# EAGLE schematic masterV05a (EAGLE 6.1), part 2 of 2
## Sheet 11 of 11
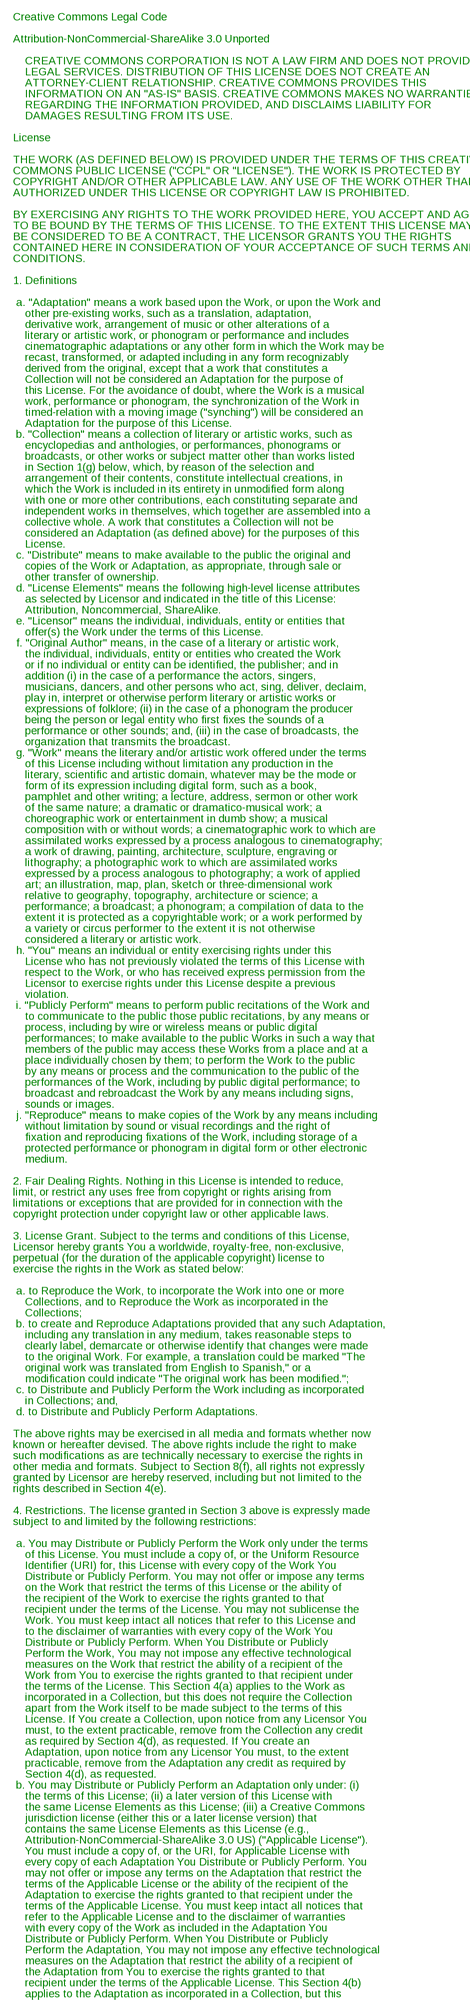
[diagram p10: schematic, sheet 11, part 1 of 2]
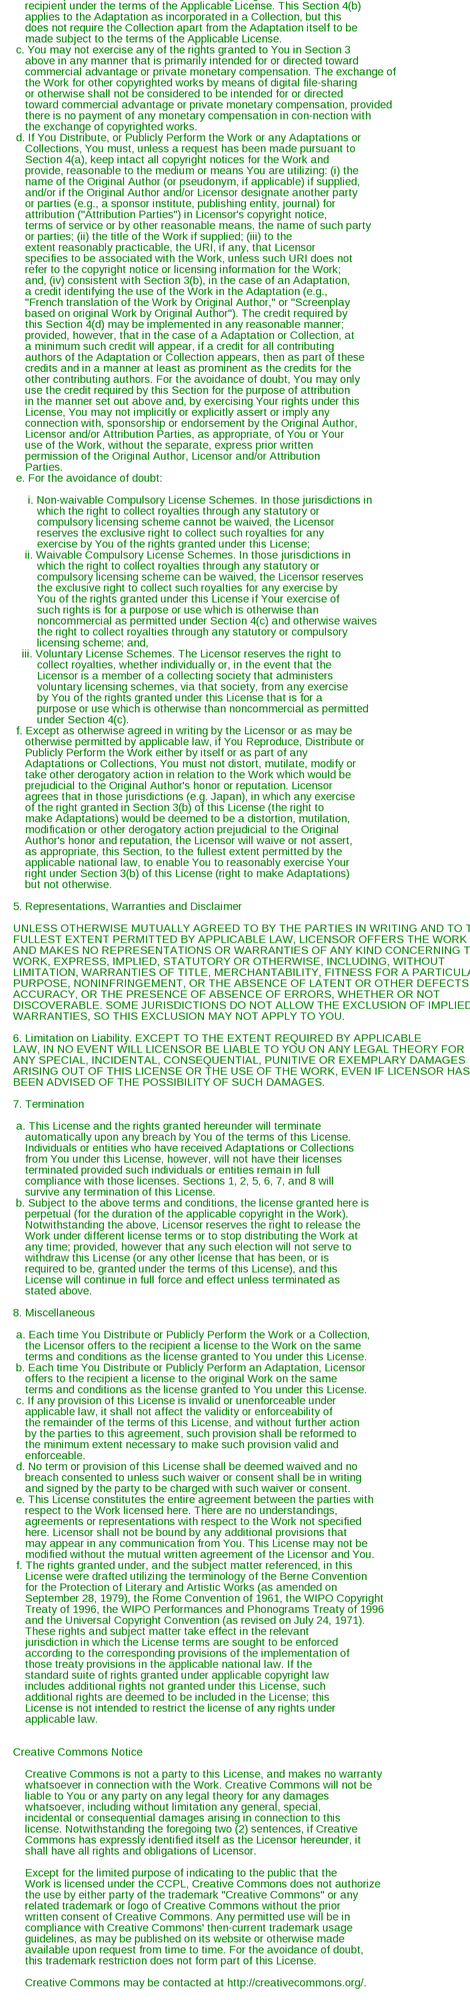
[diagram p11: schematic, sheet 11, part 2 of 2]

### Notes on the sheet
- Creative Commons Legal Code
- Attribution-NonCommercial-ShareAlike 3.0 Unported
- CREATIVE COMMONS CORPORATION IS NOT A LAW FIRM AND DOES NOT PROVIDE
- LEGAL SERVICES. DISTRIBUTION OF THIS LICENSE DOES NOT CREATE AN
- ATTORNEY-CLIENT RELATIONSHIP. CREATIVE COMMONS PROVIDES THIS
- INFORMATION ON AN "AS-IS" BASIS. CREATIVE COMMONS MAKES NO WARRANTIES
- REGARDING THE INFORMATION PROVIDED, AND DISCLAIMS LIABILITY FOR
- DAMAGES RESULTING FROM ITS USE.
- License
- THE WORK (AS DEFINED BELOW) IS PROVIDED UNDER THE TERMS OF THIS CREATIVE
- COMMONS PUBLIC LICENSE ("CCPL" OR "LICENSE"). THE WORK IS PROTECTED BY
- COPYRIGHT AND/OR OTHER APPLICABLE LAW. ANY USE OF THE WORK OTHER THAN AS
- AUTHORIZED UNDER THIS LICENSE OR COPYRIGHT LAW IS PROHIBITED.
- BY EXERCISING ANY RIGHTS TO THE WORK PROVIDED HERE, YOU ACCEPT AND AGREE
- TO BE BOUND BY THE TERMS OF THIS LICENSE. TO THE EXTENT THIS LICENSE MAY
- BE CONSIDERED TO BE A CONTRACT, THE LICENSOR GRANTS YOU THE RIGHTS
- CONTAINED HERE IN CONSIDERATION OF YOUR ACCEPTANCE OF SUCH TERMS AND
- CONDITIONS.
- 1. Definitions
- a. "Adaptation" means a work based upon the Work, or upon the Work and
- other pre-existing works, such as a translation, adaptation,
- derivative work, arrangement of music or other alterations of a
- literary or artistic work, or phonogram or performance and includes
- cinematographic adaptations or any other form in which the Work may be
- recast, transformed, or adapted including in any form recognizably
- derived from the original, except that a work that constitutes a
- Collection will not be considered an Adaptation for the purpose of
- this License. For the avoidance of doubt, where the Work is a musical
- work, performance or phonogram, the synchronization of the Work in
- timed-relation with a moving image ("synching") will be considered an
- Adaptation for the purpose of this License.
- b. "Collection" means a collection of literary or artistic works, such as
- encyclopedias and anthologies, or performances, phonograms or
- broadcasts, or other works or subject matter other than works listed
- in Section 1(g) below, which, by reason of the selection and
- arrangement of their contents, constitute intellectual creations, in
- which the Work is included in its entirety in unmodified form along
- with one or more other contributions, each constituting separate and
- independent works in themselves, which together are assembled into a
- collective whole. A work that constitutes a Collection will not be
- considered an Adaptation (as defined above) for the purposes of this
- License.
- c. "Distribute" means to make available to the public the original and
- copies of the Work or Adaptation, as appropriate, through sale or
- other transfer of ownership.
- d. "License Elements" means the following high-level license attributes
- as selected by Licensor and indicated in the title of this License:
- Attribution, Noncommercial, ShareAlike.
- e. "Licensor" means the individual, individuals, entity or entities that
- offer(s) the Work under the terms of this License.
- f. "Original Author" means, in the case of a literary or artistic work,
- the individual, individuals, entity or entities who created the Work
- or if no individual or entity can be identified, the publisher; and in
- addition (i) in the case of a performance the actors, singers,
- musicians, dancers, and other persons who act, sing, deliver, declaim,
- play in, interpret or otherwise perform literary or artistic works or
- expressions of folklore; (ii) in the case of a phonogram the producer
- being the person or legal entity who first fixes the sounds of a
- performance or other sounds; and, (iii) in the case of broadcasts, the
- organization that transmits the broadcast.
- g. "Work" means the literary and/or artistic work offered under the terms
- of this License including without limitation any production in the
- literary, scientific and artistic domain, whatever may be the mode or
- form of its expression including digital form, such as a book,
- pamphlet and other writing; a lecture, address, sermon or other work
- of the same nature; a dramatic or dramatico-musical work; a
- choreographic work or entertainment in dumb show; a musical
- composition with or without words; a cinematographic work to which are
- assimilated works expressed by a process analogous to cinematography;
- a work of drawing, painting, architecture, sculpture, engraving or
- lithography; a photographic work to which are assimilated works
- expressed by a process analogous to photography; a work of applied
- art; an illustration, map, plan, sketch or three-dimensional work
- relative to geography, topography, architecture or science; a
- performance; a broadcast; a phonogram; a compilation of data to the
- extent it is protected as a copyrightable work; or a work performed by
- a variety or circus performer to the extent it is not otherwise
- considered a literary or artistic work.
- h. "You" means an individual or entity exercising rights under this
- License who has not previously violated the terms of this License with
- respect to the Work, or who has received express permission from the
- Licensor to exercise rights under this License despite a previous
- violation.
- i. "Publicly Perform" means to perform public recitations of the Work and
- to communicate to the public those public recitations, by any means or
- process, including by wire or wireless means or public digital
- performances; to make available to the public Works in such a way that
- members of the public may access these Works from a place and at a
- place individually chosen by them; to perform the Work to the public
- by any means or process and the communication to the public of the
- performances of the Work, including by public digital performance; to
- broadcast and rebroadcast the Work by any means including signs,
- sounds or images.
- j. "Reproduce" means to make copies of the Work by any means including
- without limitation by sound or visual recordings and the right of
- fixation and reproducing fixations of the Work, including storage of a
- protected performance or phonogram in digital form or other electronic
- medium.
- 2. Fair Dealing Rights. Nothing in this License is intended to reduce,
- limit, or restrict any uses free from copyright or rights arising from
- limitations or exceptions that are provided for in connection with the
- copyright protection under copyright law or other applicable laws.
- 3. License Grant. Subject to the terms and conditions of this License,
- Licensor hereby grants You a worldwide, royalty-free, non-exclusive,
- perpetual (for the duration of the applicable copyright) license to
- exercise the rights in the Work as stated below:
- a. to Reproduce the Work, to incorporate the Work into one or more
- Collections, and to Reproduce the Work as incorporated in the
- Collections;
- b. to create and Reproduce Adaptations provided that any such Adaptation,
- including any translation in any medium, takes reasonable steps to
- clearly label, demarcate or otherwise identify that changes were made
- to the original Work. For example, a translation could be marked "The
- original work was translated from English to Spanish," or a
- modification could indicate "The original work has been modified.";
- c. to Distribute and Publicly Perform the Work including as incorporated
- in Collections; and,
- d. to Distribute and Publicly Perform Adaptations.
- The above rights may be exercised in all media and formats whether now
- known or hereafter devised. The above rights include the right to make
- such modifications as are technically necessary to exercise the rights in
- other media and formats. Subject to Section 8(f), all rights not expressly
- granted by Licensor are hereby reserved, including but not limited to the
- rights described in Section 4(e).
- 4. Restrictions. The license granted in Section 3 above is expressly made
- subject to and limited by the following restrictions:
- a. You may Distribute or Publicly Perform the Work only under the terms
- of this License. You must include a copy of, or the Uniform Resource
- Identifier (URI) for, this License with every copy of the Work You
- Distribute or Publicly Perform. You may not offer or impose any terms
- on the Work that restrict the terms of this License or the ability of
- the recipient of the Work to exercise the rights granted to that
- recipient under the terms of the License. You may not sublicense the
- Work. You must keep intact all notices that refer to this License and
- to the disclaimer of warranties with every copy of the Work You
- Distribute or Publicly Perform. When You Distribute or Publicly
- Perform the Work, You may not impose any effective technological
- measures on the Work that restrict the ability of a recipient of the
- Work from You to exercise the rights granted to that recipient under
- the terms of the License. This Section 4(a) applies to the Work as
- incorporated in a Collection, but this does not require the Collection
- apart from the Work itself to be made subject to the terms of this
- License. If You create a Collection, upon notice from any Licensor You
- must, to the extent practicable, remove from the Collection any credit
- as required by Section 4(d), as requested. If You create an
- Adaptation, upon notice from any Licensor You must, to the extent
- practicable, remove from the Adaptation any credit as required by
- Section 4(d), as requested.
- b. You may Distribute or Publicly Perform an Adaptation only under: (i)
- the terms of this License; (ii) a later version of this License with
- the same License Elements as this License; (iii) a Creative Commons
- jurisdiction license (either this or a later license version) that
- contains the same License Elements as this License (e.g.,
- Attribution-NonCommercial-ShareAlike 3.0 US) ("Applicable License").
- You must include a copy of, or the URI, for Applicable License with
- every copy of each Adaptation You Distribute or Publicly Perform. You
- may not offer or impose any terms on the Adaptation that restrict the
- terms of the Applicable License or the ability of the recipient of the
- Adaptation to exercise the rights granted to that recipient under the
- terms of the Applicable License. You must keep intact all notices that
- refer to the Applicable License and to the disclaimer of warranties
- with every copy of the Work as included in the Adaptation You
- Distribute or Publicly Perform. When You Distribute or Publicly
- Perform the Adaptation, You may not impose any effective technological
- measures on the Adaptation that restrict the ability of a recipient of
- the Adaptation from You to exercise the rights granted to that
- recipient under the terms of the Applicable License. This Section 4(b)
- applies to the Adaptation as incorporated in a Collection, but this
- does not require the Collection apart from the Adaptation itself to be
- made subject to the terms of the Applicable License.
- c. You may not exercise any of the rights granted to You in Section 3
- above in any manner that is primarily intended for or directed toward
- commercial advantage or private monetary compensation. The exchange of
- the Work for other copyrighted works by means of digital file-sharing
- or otherwise shall not be considered to be intended for or directed
- toward commercial advantage or private monetary compensation, provided
- there is no payment of any monetary compensation in con-nection with
- the exchange of copyrighted works.
- d. If You Distribute, or Publicly Perform the Work or any Adaptations or
- Collections, You must, unless a request has been made pursuant to
- Section 4(a), keep intact all copyright notices for the Work and
- provide, reasonable to the medium or means You are utilizing: (i) the
- name of the Original Author (or pseudonym, if applicable) if supplied,
- and/or if the Original Author and/or Licensor designate another party
- or parties (e.g., a sponsor institute, publishing entity, journal) for
- attribution ("Attribution Parties") in Licensor's copyright notice,
- terms of service or by other reasonable means, the name of such party
- or parties; (ii) the title of the Work if supplied; (iii) to the
- extent reasonably practicable, the URI, if any, that Licensor
- specifies to be associated with the Work, unless such URI does not
- refer to the copyright notice or licensing information for the Work;
- and, (iv) consistent with Section 3(b), in the case of an Adaptation,
- a credit identifying the use of the Work in the Adaptation (e.g.,
- "French translation of the Work by Original Author," or "Screenplay
- based on original Work by Original Author"). The credit required by
- this Section 4(d) may be implemented in any reasonable manner;
- provided, however, that in the case of a Adaptation or Collection, at
- a minimum such credit will appear, if a credit for all contributing
- authors of the Adaptation or Collection appears, then as part of these
- credits and in a manner at least as prominent as the credits for the
- other contributing authors. For the avoidance of doubt, You may only
- use the credit required by this Section for the purpose of attribution
- in the manner set out above and, by exercising Your rights under this
- License, You may not implicitly or explicitly assert or imply any
- connection with, sponsorship or endorsement by the Original Author,
- Licensor and/or Attribution Parties, as appropriate, of You or Your
- use of the Work, without the separate, express prior written
- permission of the Original Author, Licensor and/or Attribution
- Parties.
- e. For the avoidance of doubt:
- i. Non-waivable Compulsory License Schemes. In those jurisdictions in
- which the right to collect royalties through any statutory or
- compulsory licensing scheme cannot be waived, the Licensor
- reserves the exclusive right to collect such royalties for any
- exercise by You of the rights granted under this License;
- ii. Waivable Compulsory License Schemes. In those jurisdictions in
- which the right to collect royalties through any statutory or
- compulsory licensing scheme can be waived, the Licensor reserves
- the exclusive right to collect such royalties for any exercise by
- You of the rights granted under this License if Your exercise of
- such rights is for a purpose or use which is otherwise than
- noncommercial as permitted under Section 4(c) and otherwise waives
- the right to collect royalties through any statutory or compulsory
- licensing scheme; and,
- iii. Voluntary License Schemes. The Licensor reserves the right to
- collect royalties, whether individually or, in the event that the
- Licensor is a member of a collecting society that administers
- voluntary licensing schemes, via that society, from any exercise
- by You of the rights granted under this License that is for a
- purpose or use which is otherwise than noncommercial as permitted
- under Section 4(c).
- f. Except as otherwise agreed in writing by the Licensor or as may be
- otherwise permitted by applicable law, if You Reproduce, Distribute or
- Publicly Perform the Work either by itself or as part of any
- Adaptations or Collections, You must not distort, mutilate, modify or
- take other derogatory action in relation to the Work which would be
- prejudicial to the Original Author's honor or reputation. Licensor
- agrees that in those jurisdictions (e.g. Japan), in which any exercise
- of the right granted in Section 3(b) of this License (the right to
- make Adaptations) would be deemed to be a distortion, mutilation,
- modification or other derogatory action prejudicial to the Original
- Author's honor and reputation, the Licensor will waive or not assert,
- as appropriate, this Section, to the fullest extent permitted by the
- applicable national law, to enable You to reasonably exercise Your
- right under Section 3(b) of this License (right to make Adaptations)
- but not otherwise.
- 5. Representations, Warranties and Disclaimer
- UNLESS OTHERWISE MUTUALLY AGREED TO BY THE PARTIES IN WRITING AND TO THE
- FULLEST EXTENT PERMITTED BY APPLICABLE LAW, LICENSOR OFFERS THE WORK AS-IS
- AND MAKES NO REPRESENTATIONS OR WARRANTIES OF ANY KIND CONCERNING THE
- WORK, EXPRESS, IMPLIED, STATUTORY OR OTHERWISE, INCLUDING, WITHOUT
- LIMITATION, WARRANTIES OF TITLE, MERCHANTABILITY, FITNESS FOR A PARTICULAR
- PURPOSE, NONINFRINGEMENT, OR THE ABSENCE OF LATENT OR OTHER DEFECTS,
- ACCURACY, OR THE PRESENCE OF ABSENCE OF ERRORS, WHETHER OR NOT
- DISCOVERABLE. SOME JURISDICTIONS DO NOT ALLOW THE EXCLUSION OF IMPLIED
- WARRANTIES, SO THIS EXCLUSION MAY NOT APPLY TO YOU.
- 6. Limitation on Liability. EXCEPT TO THE EXTENT REQUIRED BY APPLICABLE
- LAW, IN NO EVENT WILL LICENSOR BE LIABLE TO YOU ON ANY LEGAL THEORY FOR
- ANY SPECIAL, INCIDENTAL, CONSEQUENTIAL, PUNITIVE OR EXEMPLARY DAMAGES
- ARISING OUT OF THIS LICENSE OR THE USE OF THE WORK, EVEN IF LICENSOR HAS
- BEEN ADVISED OF THE POSSIBILITY OF SUCH DAMAGES.
- 7. Termination
- a. This License and the rights granted hereunder will terminate
- automatically upon any breach by You of the terms of this License.
- Individuals or entities who have received Adaptations or Collections
- from You under this License, however, will not have their licenses
- terminated provided such individuals or entities remain in full
- compliance with those licenses. Sections 1, 2, 5, 6, 7, and 8 will
- survive any termination of this License.
- b. Subject to the above terms and conditions, the license granted here is
- perpetual (for the duration of the applicable copyright in the Work).
- Notwithstanding the above, Licensor reserves the right to release the
- Work under different license terms or to stop distributing the Work at
- any time; provided, however that any such election will not serve to
- withdraw this License (or any other license that has been, or is
- required to be, granted under the terms of this License), and this
- License will continue in full force and effect unless terminated as
- stated above.
- 8. Miscellaneous
- a. Each time You Distribute or Publicly Perform the Work or a Collection,
- the Licensor offers to the recipient a license to the Work on the same
- terms and conditions as the license granted to You under this License.
- b. Each time You Distribute or Publicly Perform an Adaptation, Licensor
- offers to the recipient a license to the original Work on the same
- terms and conditions as the license granted to You under this License.
- c. If any provision of this License is invalid or unenforceable under
- applicable law, it shall not affect the validity or enforceability of
- the remainder of the terms of this License, and without further action
- by the parties to this agreement, such provision shall be reformed to
- the minimum extent necessary to make such provision valid and
- enforceable.
- d. No term or provision of this License shall be deemed waived and no
- breach consented to unless such waiver or consent shall be in writing
- and signed by the party to be charged with such waiver or consent.
- e. This License constitutes the entire agreement between the parties with
- respect to the Work licensed here. There are no understandings,
- agreements or representations with respect to the Work not specified
- here. Licensor shall not be bound by any additional provisions that
- may appear in any communication from You. This License may not be
- modified without the mutual written agreement of the Licensor and You.
- f. The rights granted under, and the subject matter referenced, in this
- License were drafted utilizing the terminology of the Berne Convention
- for the Protection of Literary and Artistic Works (as amended on
- September 28, 1979), the Rome Convention of 1961, the WIPO Copyright
- Treaty of 1996, the WIPO Performances and Phonograms Treaty of 1996
- and the Universal Copyright Convention (as revised on July 24, 1971).
- These rights and subject matter take effect in the relevant
- jurisdiction in which the License terms are sought to be enforced
- according to the corresponding provisions of the implementation of
- those treaty provisions in the applicable national law. If the
- standard suite of rights granted under applicable copyright law
- includes additional rights not granted under this License, such
- additional rights are deemed to be included in the License; this
- License is not intended to restrict the license of any rights under
- applicable law.
- Creative Commons Notice
- Creative Commons is not a party to this License, and makes no warranty
- whatsoever in connection with the Work. Creative Commons will not be
- liable to You or any party on any legal theory for any damages
- whatsoever, including without limitation any general, special,
- incidental or consequential damages arising in connection to this
- license. Notwithstanding the foregoing two (2) sentences, if Creative
- Commons has expressly identified itself as the Licensor hereunder, it
- shall have all rights and obligations of Licensor.
- Except for the limited purpose of indicating to the public that the
- Work is licensed under the CCPL, Creative Commons does not authorize
- the use by either party of the trademark "Creative Commons" or any
- related trademark or logo of Creative Commons without the prior
- written consent of Creative Commons. Any permitted use will be in
- compliance with Creative Commons' then-current trademark usage
- guidelines, as may be published on its website or otherwise made
- available upon request from time to time. For the avoidance of doubt,
- this trademark restriction does not form part of this License.
- Creative Commons may be contacted at http://creativecommons.org/.

## Library data of the parts
AC1-AC4 AC8 AC10-AC15 C1-C13 C15-C17 C23-C30 C35-C41 C45-C47 Q1C1 Q1C2 = rcl:C-EU: CAPACITOR, European symbol
C14 C18 C42 = resistor:CPOL-EU: POLARIZED CAPACITOR, European symbol
C19-C22 C31-C34 C43 C44 = rcl:CPOL-EU: POLARIZED CAPACITOR, European symbol
CN1 = microbuilder:MICROSD: MicroSD/Transflash Card Holder with SPI pinout 3M: 2908-05WB-M6 4UConnector: 19656 Footprint courtesy: Adafruit Industries
D1-D4 D9 D12 D14 = diode:ZENER-DIODE: Z-Diode
D5-D8 D10 D11 D13 = diode:DIODE-: DIODE
D15 = bms-hsrm:RS07J
DC2-DC5 = bms-hsrm:ISFXXXXA
IC2 = 74xx-eu:74*04: Hex INVERTER
IC6 IC9 = linear:*555: TIMER
IC8 = 40xx:4082: Dual 4-input AND
IC10 IC11 = 74ac-logic:74AC11074: Dual positive edge triggered D-type FLIP FLOP
JP2 = pinhead:PINHD-2X5: PIN HEADER
KK2 = heatsink:SK129-PAD: HEATSINK manufacturer Fischer/distributor Buerklin
L1 L5 = EagleLibrary_Wuerth_Elektronik_eiSos_Version_6-12:WE-PD: SMD-Shielded Power Inductors WE-PD - Magnetically shielded version which results in a low leakage field - High storage capacity - Low self-losses - Highest possible current loading for SMD-Inducors -- Switching regulators with low operating voltages (computer, laptop, mobile phones, pagers) -- Integrated DC/DC-converter -- Is recommended for the application with switching regulators from National Semiconductor, Linear Technology, Texas Instruments and Fairchild Semiconductor, ect. -- Graphic cards -- Plastic base: Because of the one piece construction these are more suitable for high vibration or shock applications
L2-L4 L6 = EagleLibrary_Wuerth_Elektronik_eiSos_Version_6-12:WE-PMI: Power Multilayer Inductor WE-PMI - Compact multilayer type - Suitable for applocations with high currents up to 2.5 A - No crosstalk -- DC / DC converters especially at high switching frequencies -- Portable devices like PDA and digital cameras
LED1-LED5 = led:LED: LED OSRAM: - CHIPLED LG R971, LG N971, LY N971, LG Q971, LY Q971, LO R971, LY R971 LH N974, LH R974 LS Q976, LO Q976, LY Q976 LO Q996 - Hyper CHIPLED LW Q18S LB Q993, LB Q99A, LB R99A - SideLED LS A670, LO A670, LY A670, LG A670, LP A670 LB A673, LV A673, LT A673, LW A673 LH A674 LY A675 LS A676, LA A676, LO A676, LY A676, LW A676 LS A679, LY A679, LG A679 - Hyper Micro SIDELED® LS Y876, LA Y876, LO Y876, LY Y876 LT Y87S - SmartLED LW L88C, LW L88S LB L89C, LB L89S, LG L890 LS L89K, LO L89K, LY L89K LS L896, LA L896, LO L896, LY L896 - TOPLED LS T670, LO T670, LY T670, LG T670, LP T670 LSG T670, LSP T670, LSY T670, LOP T670, LYG T670 LG T671, LOG T671, LSG T671 LB T673, LV T673, LT T673, LW T673 LH T674 LS T676, LA T676, LO T676, LY T676, LB T676, LH T676, LSB T676, LW T676 LB T67C, LV T67C, LT T67C, LS T67K, LO T67K, LY T67K, LW E67C LS E67B, LA E67B, LO E67B, LY E67B, LB E67C, LV E67C, LT E67C LW T67C LS T679, LY T679, LG T679 LS T770, LO T770, LY T770, LG T770, LP T770 LB T773, LV T773, LT T773, LW T773 LH T774 LS E675, LA E675, LY E675, LS T675 LS T776, LA T776, LO T776, LY T776, LB T776 LHGB T686 LT T68C, LB T68C - Hyper Mini TOPLED® LB M676 - Mini TOPLED Santana® LG M470 LS M47K, LO M47K, LY M47K Source: http://www.osram.convergy.de LUXEON: - LUMILED® LXK2-PW12-R00, LXK2-PW12-S00, LXK2-PW14-U00, LXK2-PW14-V00 LXK2-PM12-R00, LXK2-PM12-S00, LXK2-PM14-U00 LXK2-PE12-Q00, LXK2-PE12-R00, LXK2-PE12-S00, LXK2-PE14-T00, LXK2-PE14-U00 LXK2-PB12-K00, LXK2-PB12-L00, LXK2-PB12-M00, LXK2-PB14-N00, LXK2-PB14-P00, LXK2-PB14-Q00 LXK2-PR12-L00, LXK2-PR12-M00, LXK2-PR14-Q00, LXK2-PR14-R00 LXK2-PD12-Q00, LXK2-PD12-R00, LXK2-PD12-S00 LXK2-PH12-R00, LXK2-PH12-S00 LXK2-PL12-P00, LXK2-PL12-Q00, LXK2-PL12-R00 Source: www.luxeon.com KINGBRIGHT: KA-3528ASYC Source: www.kingbright.com
OK2 OK3 = optocoupler:LTV816: OPTO COUPLER Source: LITEON, LTV816.pdf; OC_FARNELL: unknown; OC_NEWARK: unknown
Q1-Q6 = transistor-power:N-MOSFET-SO8: N-Channel MOSFET Example: FDS7760A; N-Channel Logic Level PowerTrench® MOSFET FDS2572; N-Channel UltraFET® Trench MOSFET Source: www.fairchildsemi.com
R1-R17 R19-R22 R24 R26-R45 R47-R58 R60 R61 R63-R68 R72-R82 RA1 RA2 RA13 RA15-RA17 RA19 = rcl:R-EU_: RESISTOR, European symbol
R46 R59 R62 = pot:TRIM_EU-: POTENTIOMETER
R84 = resistor:R-EU_: RESISTOR, European symbol
S1 = smd-special:SWS001: SMD Dip Switch 1 pol.
SJ1 = jumper:SJ2W: SMD solder JUMPER
U1 U2 U4-U6 U8 U9 = microbuilder:74LVC1G04: 74LVC1G04 - Single Inverter Gate SOT23-5 SN74LVC1G04DBVR - Digikey: 296-11599-1-ND
U3 = _hhn_at90can32_64_128_v2:AT90CAN*: ATMEL AVR AT90CAN32-..A. / 64-..A. / 128-..A., TQFP64 with 0.8mm pad spacing (Atmel Package Code 'A2 64': 64-Lead, Thin 1.0 mm / 0.03937 in. Plastic Gull Wing Quad Flat Package) Ordering Code = Product Marking / Speed (MHz) / Power Supply (V) / Operation Range AT90CANx-16AI / 16 / 2.7 .. 5.5 / Industrial (-40 .. +85)°C AT90CANx-16AU / 16 / 2.7 .. 5.5 / Industrial Green (-40 .. +85)°C x = 32 / 64 / 128 (KB of ISP Flash Memory) Author: Dipl.-Ing. FH Rainer Bayer HHN Hochschule Heilbronn, rainer.bayer@hs-heilbronn.de Ingenieurbüro ing-rb, mail@ing-rb.de
U7 = SmartPrj:LP2985-XXDBVR: ULTRALOW-POWER 50-mA LOW-DROPOUT LINEAR REGULATORS 50-mA Low-Dropout Regulator Source: http://focus.ti.com/lit/ds/symlink/tps77001.pdf
U$6 = bms-hsrm:LR645
U$9 = bms-hsrm:ADUM1401
U$10 = bms-hsrm:DN2540
U$11 = bms-hsrm:ADUM1301
U$14 = bms-hsrm:LT6656
U$16 = bms-hsrm:LTC1864
U$17 = bms-hsrm:MCP2551
U$20 = bms-hsrm:ADUM1201
U$26 U$99 = bms-hsrm:LT1716
U$28 U$101 = bms-hsrm:LT6650
U$45 U$47 U$58 U$71 U$80 = bms-hsrm:2N7002
U$48 = bms-hsrm:LT1782
U$50 = bms-hsrm:TSR1
X1 X2 X9 X13 = con-molex-micro-fit-3_0:HEADER_POS2_?: Molex - Micro-Fit 3.0 Series connector, 3.00mm (0.118") pitch header, 2 positions.
X3 = con-molex-micro-fit-3_0:HEADER_POS14_?: Molex - Micro-Fit 3.0 Series connector, 3.00mm (0.118") pitch header, 14 positions.
X4-X6 X8 = con-molex-micro-fit-3_0:HEADER_POS4_?: Molex - Micro-Fit 3.0 Series connector, 3.00mm (0.118") pitch header, 4 positions.
X7 = con-molex-micro-fit-3_0:HEADER_POS3_?: Molex - Micro-Fit 3.0 Series connector, 3.00mm (0.118") pitch header, 3 positions.
X10 = con-molex-minifitjr:MINI-FIT-JR-04
Y1 = crystal:CRYSTAL: CRYSTAL